# EAGLE design USB2TTL485 (EAGLE 6.2)
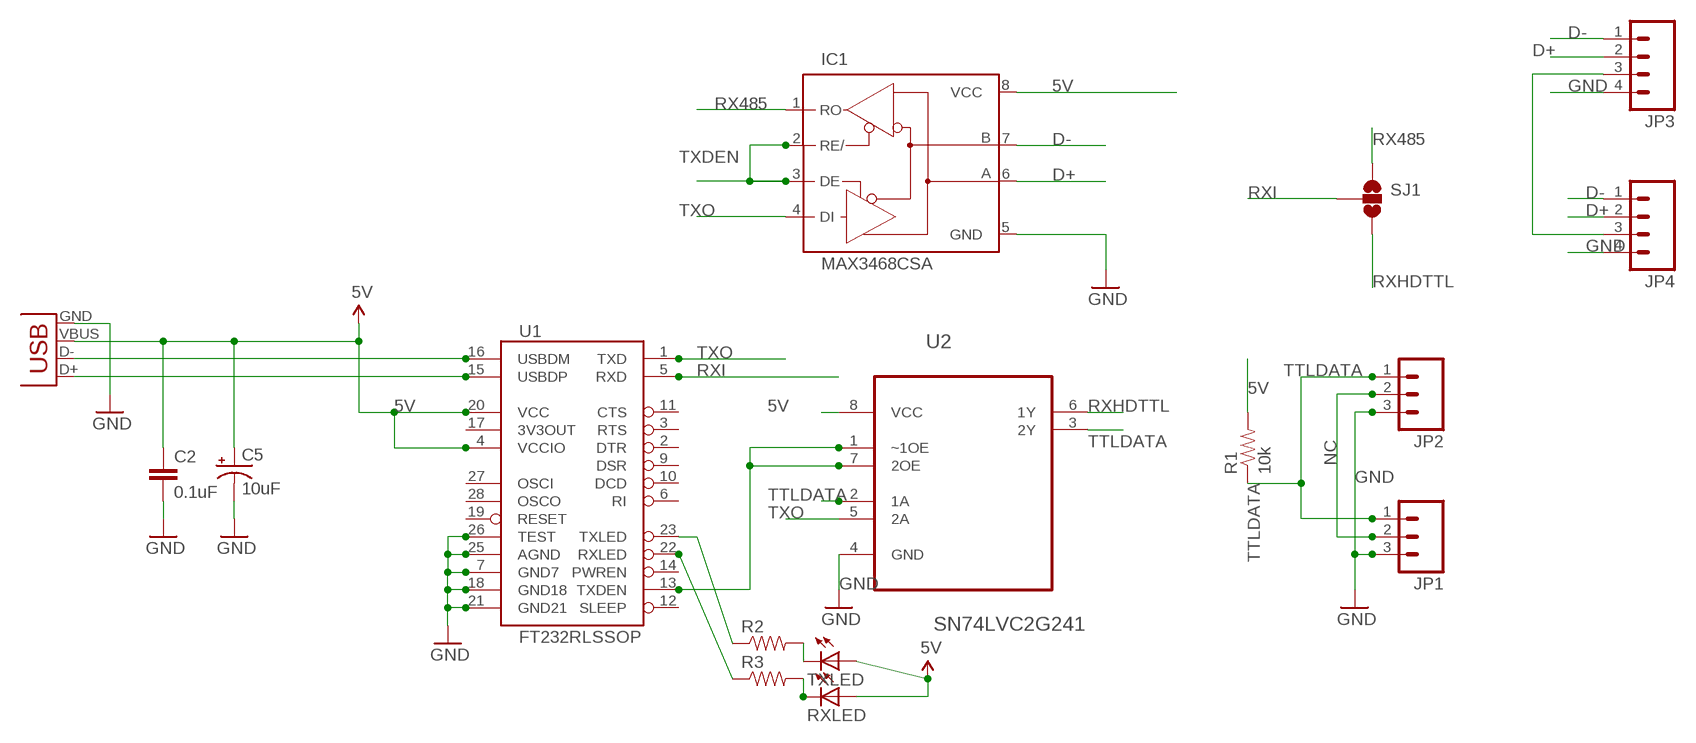
[diagram p0: schematic, sheet 1]

## Parts
C2  0.1uF  CAP0402-CAP  [0402-CAP]
C5  10uF  CAP_POL1206  [EIA3216]
IC1  MAX3468CSA  [SO08]
JP1  M03LOCK_LONGPADS  [1X03_LOCK_LONGPADS]
JP2  M03LOCK_LONGPADS  [1X03_LOCK_LONGPADS]
JP3  M04LOCK_LONGPADS  [1X04_LOCK_LONGPADS]
JP4  M04LOCK_LONGPADS  [1X04_LOCK_LONGPADS]
R1  10k  RESISTOR0603-RES  [0603-RES]
R2  RESISTOR0603-RES  [0603-RES]
R3  RESISTOR0603-RES  [0603-RES]
RXLED  LED0603  [LED-0603]
SJ1  SOLDERJUMPER_2WAYT  [SJ_2]
TXLED  LED0603  [LED-0603]
U1  FT232RLSSOP  [SSOP28DB]
U2  SN74LVC2G241  [SOP65P400X130-8N]
X2  USB-SMD-NS  [USB-MINIB-NOSTOP]

## Nets
5V: C2.1 C5.A(+) IC1.8(VCC) R1.2 RXLED.A TXLED.A U1.4(VCCIO) U1.20(VCC) U2.8(VCC) X2.VBUS
D+: IC1.6(A) JP3.2 JP4.2
D-: IC1.7(B) JP3.1 JP4.1
GND [power]: C2.2 C5.C(-) IC1.5(GND) JP1.3 JP2.3 JP3.4 JP4.4 U1.7(GND7) U1.18(GND18) U1.21(GND21) U1.25(AGND) U1.26(TEST) U2.4(GND) X2.GND
N$1: R2.2 TXLED.C
N$2: R2.1 U1.23(TXLED)
N$3: R3.1 U1.22(RXLED)
N$4: JP3.3 JP4.3
N$6: R3.2 RXLED.C
NC: JP1.2 JP2.2
RX485: IC1.1(RO) SJ1.1
RXHDTTL: SJ1.3 U2.6(1Y)
RXI: SJ1.2 U1.5(RXD)
TTLDATA: JP1.1 JP2.1 R1.1 U2.2(1A) U2.3(2Y)
TXDEN: IC1.2(RE/) IC1.3(DE) U1.13(TXDEN) U2.1(~1OE) U2.7(2OE)
TXO: IC1.4(DI) U1.1(TXD) U2.5(2A)
USB_D+: U1.15(USBDP) X2.D+
USB_D-: U1.16(USBDM) X2.D-
Unconnected: U1.2(DTR) U1.3(RTS) U1.6(RI) U1.9(DSR) U1.10(DCD) U1.11(CTS) U1.12(SLEEP) U1.14(PWREN) U1.17(3V3OUT) U1.19(RESET) U1.27(OSCI) U1.28(OSCO)

## Library data of the parts
C2 = SparkFun:CAP: Capacitor Standard 0603 ceramic capacitor, and 0.1" leaded capacitor.
C5 = SparkFun:CAP_POL: Capacitor Polarized These are standard SMD and PTH capacitors. Normally 10uF, 47uF, and 100uF in electrolytic and tantalum varieties. Always verify the external diameter of the through hole cap, it varies with capacity, voltage, and manufacturer. The EIA devices should be standard.
IC1 = maxim:MAX34*: +5V, Fail-Safe, 40Mbps, Profibus RS-485/RS-422 Transceivers Source: MAX3465-MAX3469.pdf; MPN: MAX3468CSA+; OC_FARNELL: unknown; OC_NEWARK: 76K6721
JP1 JP2 = SparkFun-Connectors:M03: Header 3 Standard 3-pin 0.1" header. Use with straight break away headers (SKU : PRT-00116), right angle break away headers (PRT-00553), swiss pins (PRT-00743), machine pins (PRT-00117), and female headers (PRT-00115). Molex polarized connector foot print use with SKU : PRT-08232 with associated crimp pins and housings.
JP3 JP4 = SparkFun-Connectors:M04: Header 4 Standard 4-pin 0.1" header. Use with straight break away headers (SKU : PRT-00116), right angle break away headers (PRT-00553), swiss pins (PRT-00743), machine pins (PRT-00117), and female headers (PRT-00115). Molex polarized connector foot print use with SKU : PRT-08231 with associated crimp pins and housings. 1MM SMD Version SKU: PRT-10208
R1 = custom-cap0603:RESISTOR: Resistor
R2 R3 = SparkFun-Passives:RESISTOR: Resistor
RXLED TXLED = SparkFun-LED:LED: LEDs Standard schematic elements and footprints for 5mm, 3mm, 1206, and 0603 sized LEDs. 5mm - Spark Fun Electronics SKU : COM-00529 (and others)
SJ1 = SparkFun-Passives:SOLDERJUMPER_2WAY: Solder Jumper 2 way solder jumper
U1 = SparkFun:FT232RL: USB UART FT232RL 4th Generation USB UART (USB <-> Serial) Controller. Spark Fun Electronics SKU : COM-00650
U2 = Texas Instruments_By_element14_Batch_1:SN74LVC2G241
X2 = SparkFun:USB: USB Connectors USB-B-PTH is fully proven SKU : PRT-00139 USB-miniB is fully proven SKU : PRT-00587 USB-A-PCB is untested. USB-A-H is throughly reviewed, but untested. Spark Fun Electronics SKU : PRT-00437 USB-B-SMT is throughly reviewed, but untested. Needs silkscreen touching up. USB-A-S has not been used/tested USB-MB-H has not been used/tested

## Net classes
0 default: width 0.203 mm
1 power: width 0.254 mm

## Board
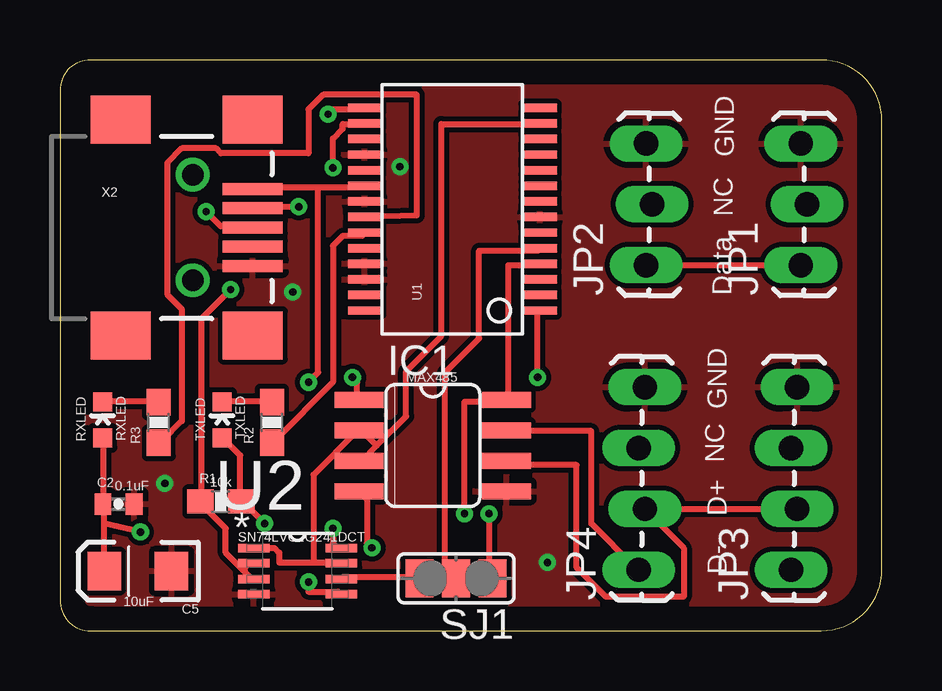
[diagram p1: board, top side]
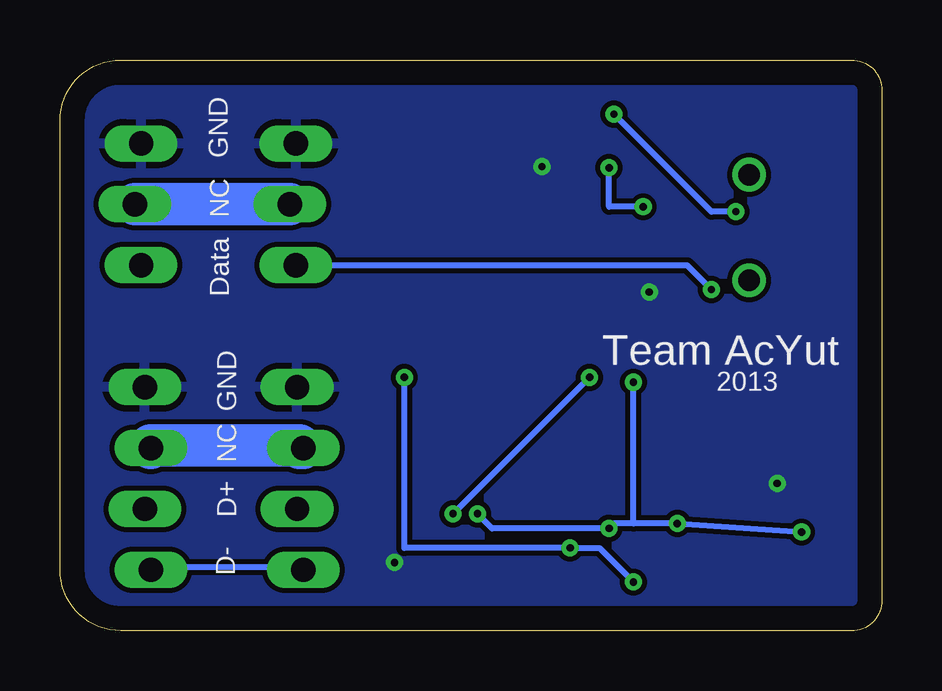
[diagram p2: board, bottom side, seen from below]

Size 34.27 x 23.8 mm. Coordinates in mm from the lower left corner, seen from the top.
Outline: 31.73,23.8 1.27,23.8 arc90 0,22.53 0,1.27 arc90 1.27,0 31.73,0 arc90 34.27,2.54 34.27,21.26 arc90 31.73,23.8
Copper layers (1*16): Top 0.035mm / dielectric 1.5mm / Bottom 0.035mm
Design rules: minimum track width 10mil, minimum drill 12mil, track to track 8mil, track to pad 8mil, pad to pad 8mil, via to via 8mil, smd to smd 8mil, copper to edge 40mil, drill to drill 8mil, minimum pad ring 10mil, minimum via ring 8mil, stop-mask expansion 4mil, vias tented up to drill 0mil, thermal gap 10mil

### Footprints (pad centres in the part's own frame; a part is rotated, then mirrored left to right if it is on the bottom)
0402-CAP = smd 0.7 x 0.9: 1 -0.65,0; 2 0.65,0
EIA3216 = smd 1.4 x 1.6: A 1.4,0; C -1.4,0
SO08 = smd 0.66 x 2.032: 1 -1.905,-3.073; 2 -0.635,-3.073; 3 0.635,-3.073; 4 1.905,-3.073; 5 1.905,3.073; 6 0.635,3.073; 7 -0.635,3.073; 8 -1.905,3.073
1X03_LOCK_LONGPADS = drill 1.016 long: 1 0,0; 2 2.54,-0.254; 3 5.08,0
1X04_LOCK_LONGPADS = drill 1.016 long: 1 0,0; 2 2.54,-0.254; 3 5.08,0; 4 7.62,-0.254
0603-RES = smd 1.1 x 1: 1 -0.85,0; 2 0.85,0
LED-0603 = smd 0.8 x 0.8: A 0,-0.75; C 0,0.75
SJ_2 = smd 1.168 x 1.6: 1 -1.524,0; 2 0,0; 3 1.524,0
SSOP28DB = smd 0.348 x 1.397: 1 -4.225,-3.656; 2 -3.575,-3.656; 3 -2.925,-3.656; 4 -2.275,-3.656; 5 -1.625,-3.656; 6 -0.975,-3.656; 7 -0.325,-3.656; 8 0.325,-3.656; 9 0.975,-3.656; 10 1.625,-3.656; 11 2.275,-3.656; 12 2.925,-3.656; 13 3.575,-3.656; 14 4.225,-3.656; 15 4.225,3.656; 16 3.575,3.656; 17 2.925,3.656; 18 2.275,3.656; 19 1.625,3.656; 20 0.975,3.656; 21 0.325,3.656; 22 -0.325,3.656; 23 -0.975,3.656; 24 -1.625,3.656; 25 -2.275,3.656; 26 -2.925,3.656; 27 -3.575,3.656; 28 -4.225,3.656
SOP65P400X130-8N = smd 1.321 x 0.356: 1 -1.829,0.965; 2 -1.829,0.33; 3 -1.829,-0.33; 4 -1.829,-0.965; 5 1.829,-0.965; 6 1.829,-0.33; 7 1.829,0.33; 8 1.829,0.965
USB-MINIB-NOSTOP = smd 2.5 x 0.5: D+ 2.5,0; D- 2.5,0.8; GND 2.5,-1.6; ID 2.5,-0.8; VBUS 2.5,1.6 | smd 2.5 x 2: G1 -3,-4.5; G2 -3,4.5; G3 2.5,4.5; G4 2.5,-4.5 | drill 0.9 pad 0.8: H1 0,2.2 | drill 0.9 pad 0.787: H2 0,-2.2

### Placement (x,y rotation side)
C2  2.44,5.28 0 top
C5  3.25,2.49 180 top
IC1  15.54,7.72 270 top
JP1  30.89,15.24 90 top
JP2  24.43,15.24 90 top
JP3  30.48,2.54 90 top
JP4  24.13,2.54 90 top
R1  6.71,5.38 0 top
R2  8.84,8.69 90 top
R3  4.11,8.69 90 top
RXLED  1.78,8.79 0 top
SJ1  16.51,2.18 180 top
TXLED  6.76,8.79 0 top
U1  16.36,17.58 90 top
U2  9.91,2.49 0 top
X2  5.54,16.81 0 top

### Tracks (layer width: path | path; a pad name or v marks a point on that pad's centre or on a via)
5V  (via drill 0.3)
  Top 0.254: U1.4 19.91,15.24 18.69,15.24 18.69,9.75 IC1.8 18.49,9.55 16.87,9.55 v16.87,4.88 | 10.77,18.49 8.13,18.49 X2.VBUS | 10.77,18.49 12.6,18.49 U1.20 | 1.83,5.28 1.83,7.92 RXLED.A | 1.83,5.28 1.83,4.47 | 1.83,4.47 1.83,2.64 C5.A | 1.83,5.28 C2.1 | TXLED.A 6.91,7.92 7.52,7.32 7.52,5.49 R1.2 7.72,5.28 v8.53,4.47 | v11.38,4.27 11.38,3.66 11.58,3.45 U2.8 | v3.35,4.12 1.83,4.47 | 10.77,18.49 10.77,10.77 v10.36,10.36
  Bottom 0.254: 10.36,4.47 v8.53,4.47 v3.35,4.12 | 10.36,4.47 11.18,4.47 v11.38,4.27 16.26,4.27 v16.87,4.88 | 10.36,4.47 v10.36,10.36
D+
  Top 0.254: IC1.6 18.69,6.91 21.54,6.91 21.54,2.64 22.76,1.42 26.01,1.42 26.01,3.45 JP4.2 JP3.2
D-
  Top 0.254: IC1.7 18.69,8.33 22.15,8.33 22.15,4.47 23.98,2.64 JP4.1
  Bottom 0.254: JP3.1 30.48,2.64 24.18,2.64 JP4.1
GND  (via drill 0.3)
  other vias: 20.32,2.84 4.37,6.15 14.17,19.35 9.7,14.12
  pour Top: 34.29,0 -0.08,0 0.53,20.37 arc-87 2.29,23.38 33.68,23.42
  pour Bottom: 34.04,23.32 34.04,0.61 0.1,0.3 0.41,23.47
N$1
  Top 0.254: TXLED.C 6.91,9.55 8.74,9.55 R2.2
N$2
  Top 0.254: R2.1 8.94,7.92 11.38,10.36 11.38,16.05 11.79,16.46 12.6,16.46 U1.23
N$3
  Top 0.254: R3.1 4.27,7.92 5.08,8.74 5.08,13.41 4.47,14.02 4.47,19.51 5.08,20.12 6.5,20.12 6.71,19.91 10.36,19.91 10.36,21.74 10.97,22.35 14.88,22.35 14.88,17.32 12.8,17.27 U1.22
N$4
  Bottom 1.778: JP4.3 24.28,7.62 24.28,7.72 30.48,7.72 JP3.3
N$6
  Top 0.254: RXLED.C 1.83,9.55 4.06,9.55 R3.2
NC
  Bottom 1.778: JP2.2 JP1.2
RX485  (via drill 0.3)
  Top 0.254: v17.88,4.88 17.88,2.23 SJ1.1 | v12.19,10.57 12.39,10.36 12.39,9.75 IC1.1
  Bottom 0.254: v12.19,10.57 v17.88,4.88
RXHDTTL
  Top 0.254: U2.6 11.79,2.23 14.83,2.23 SJ1.3
RXI
  Top 0.254: SJ1.2 16.05,2.64 16.05,10.77 17.48,12.19 17.48,15.85 19.91,15.85 U1.5
TTLDATA  (via drill 0.3)
  Top 0.254: 7.72,2.44 7.92,2.23 U2.3 | 7.72,2.44 6.91,3.25 6.91,4.27 5.89,5.28 R1.1 5.89,5.49 5.89,13.01 v7.11,14.22 | 7.72,2.44 7.72,2.64 7.92,2.85 U2.2 | JP2.1 JP1.1
  Bottom 0.254: v7.11,14.22 8.13,15.24 JP2.1
TXDEN
  Top 0.254: 10.57,2.85 9.14,2.85 9.14,3.25 8.94,3.45 U2.1 | 10.57,2.85 11.58,2.85 U2.7 | 13.21,7.72 12.6,7.11 IC1.3 | 13.21,7.72 14.43,8.94 14.43,10.82 15.9,12.29 15.9,21.13 19.91,21.13 U1.13 | 13.21,7.72 12.6,8.33 IC1.2 12.39,8.33 10.57,6.5 10.57,2.85
TXO  (via drill 0.3)
  Top 0.254: v10.36,2.03 10.36,1.63 11.58,1.63 U2.5 | v13.01,3.45 12.8,3.66 12.8,5.49 IC1.4 | v19.91,10.57 19.91,13.21 U1.1
  Bottom 0.254: v10.36,2.03 11.79,3.45 v13.01,3.45 19.91,3.45 v19.91,10.57
USB_D+  (via drill 0.3)
  Top 0.254: v11.18,21.54 11.18,21.74 12.6,21.74 U1.15 | v6.1,17.48 6.71,16.87 7.92,16.87 X2.D+
  Bottom 0.254: v11.18,21.54 7.11,17.48 v6.1,17.48
USB_D-  (via drill 0.3)
  Top 0.254: v11.38,19.3 11.38,20.52 11.79,20.93 11.79,21.13 12.6,21.13 U1.16 | v9.96,17.68 8.13,17.68 X2.D-
  Bottom 0.254: v11.38,19.3 11.38,17.68 v9.96,17.68

### Text on the board
tPlace: GND | NC | Data | MAX485 | GND | RXLED | TXLED | NC | 0.1uF | 10k | D+ | SN74LVC2G241DCT | D- | 10uF
bPlace: GND | NC | Data | Team AcYut | 2013 | GND | NC | D+ | D-